# Altium project ePBR25_ACU_Power.PrjPCB (part 2 of 2)

## Sheet 9  - UV OV Protection.SchDoc
size A4
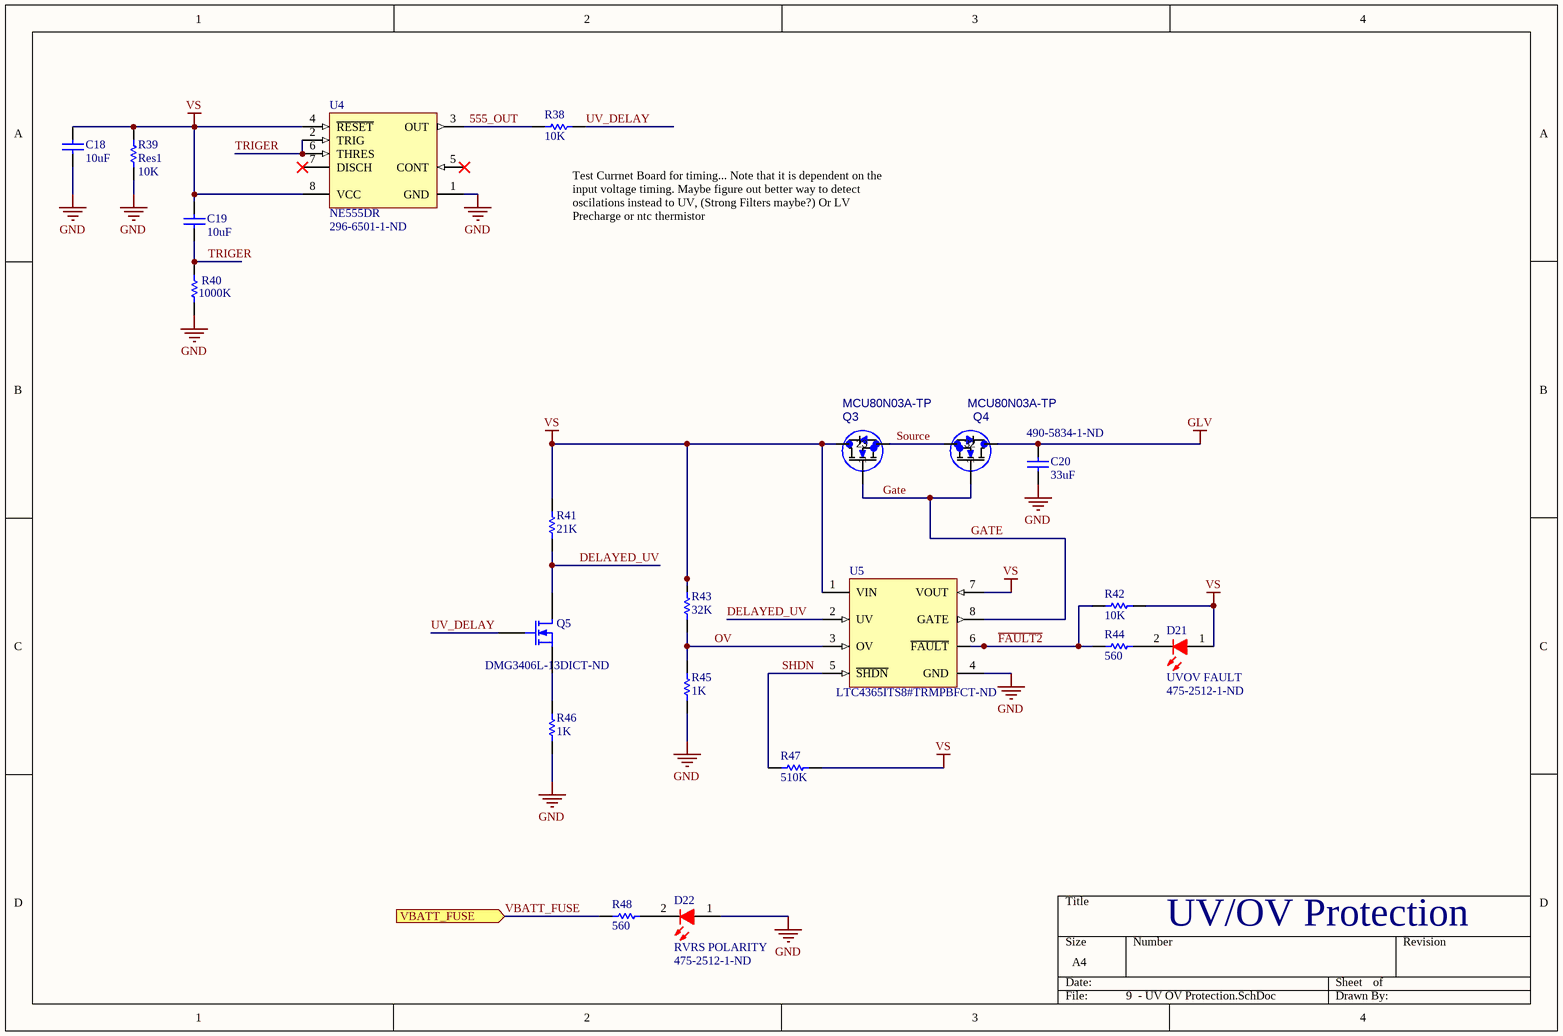
[diagram p6: 9  - UV OV Protection.SchDoc]

### Parts
C18  value 10uF  [1608[0603]]  (hidden comment: Cap Semi)
C19  value 10uF  [1608[0603]]  (hidden comment: Cap Semi)
C20  value 33uF  Supplier Part Number 1: 490-5834-1-ND  [2J-Lead 6.1 x 5.3]  (hidden comment: Cap Semi)
D21  UVOV FAULT  Supplier Part Number 1: 475-2512-1-ND  [TOSH-0603LED_RED_V]
D22  RVRS POLARITY  Supplier Part Number 1: 475-2512-1-ND  [TOSH-0603LED_RED_V]
Q3  MCU80N03A-TP  [MCU80N_MCE]
Q4  MCU80N03A-TP  [MCU80N_MCE]
Q5  Supplier Part Number 1: DMG3406L-13DICT-ND  [SOT-23_N]
R38  10K  [RESC0603(1608)_L]
R39  Res1  value 10K  [1608[0603]]
R40  1000K  [RESC0603(1608)_L]
R41  21K  [RESC0603(1608)_L]
R42  10K  [RESC0603(1608)_L]
R43  32K  [RESC0603(1608)_L]
R44  560  [RESC0603(1608)_L]
R45  1K  [RESC0603(1608)_L]
R46  1K  [RESC0603(1608)_L]
R47  510K  [RESC0603(1608)_L]
R48  560  [RESC0603(1608)_L]
U4  NE555DR  Supplier Part Number 1: 296-6501-1-ND  [D0008A_M]
U5  Supplier Part Number 1: LTC4365ITS8#TRMPBFCT-ND  [LT-TS8-8-TSOT-23_V]  (hidden comment: LTC4365ITS8#TRMPBF)

### Ports
VBATT_FUSE (in)

### Nets
GLV: C20.1 Q4.2
GND: C18.1 C20.2 D22.1(A) R39.1 R40.1 R45.1 R46.2 U4.1(GND) U5.4(GND)
VS: C18.2 C19.2 D21.1(A) Q3.2 R39.2 R41.1 R42.1 R43.2 R47.1 U4.4(~{RESET}) U4.8(VCC) U5.1(VIN) U5.7(VOUT)
555_OUT: R38.1 U4.3(OUT)
DELAYED_UV: Q5.3(D) R41.2 U5.2(UV)
~{FAULT2}: R42.2 R44.1 U5.6(~{FAULT})
GATE: Q3.1 Q4.1 U5.8(GATE)
OV: R43.1 R45.2 U5.3(OV)
SHDN: R47.2 U5.5(~{SHDN})
Source: Q3.3 Q4.3
TRIGER: C19.1 R40.2 U4.2(TRIG) U4.6(THRES)
UV_DELAY: Q5.1(G) R38.2
VBATT_FUSE: R48.1 ; port VBATT_FUSE
NetD21_2: D21.2(K) R44.2
NetD22_2: D22.2(K) R48.2
NetQ5_2: Q5.2(S) R46.1

Not connected (* = marked no-connect by the designer): U4 5(CONT)* 7(DISCH)*

### Notes on the sheet
- (near R38) Test Currnet Board for timing... Note that it is dependent on the input voltage timing. Maybe figure out better way to detect oscilations instead to UV, (Strong Filters maybe?) Or LV Precharge or ntc thermistor
- UV/OV Protection

### Library data of the parts
C18-C20 = Cap Semi: Capacitor (Semiconductor SIM Model); Published: 8-Jun-2000; LatestRevisionDate: 29-May-2009; LatestRevisionNote: IPC-7351 Footprint Added.; PackageReference: C1206; Publisher: Altium Limited; PackageDescription: Chip Capacitor; Supplier 1: Digi-Key
  C18 C19: Supplier Part Number 1: 490-10991-1-ND
D21 D22 = CMP-0444-00001-1: LED, Red 0603 (1608) 63mCd; Manufacturer: Toshiba; PartNumber: TLSU1008A(T04); Forward Current: 25 mA; Power Dissipation: 60 mW; Packing Type: Reel; Reverse Voltage: 4 V; Mounting Technology: Surface Mount; PackageDescription: 2-Pin SMT LED, 1.6 x 0.8 mm Pitch; ComponentLink1URL: http://www.toshiba-components.com/; ComponentLink1Description: Manufacturer URL; PackageReference: 0603LED_RED; ComponentLink2URL: http://www.semicon.toshiba.co.jp/info/docget.jsp?type=datasheet&lang=en&pid=TLSU1008A(T04); ComponentLink2Description: Datasheet; DatasheetVersion: Aug-08; Storage Temperature: -40 to 100 degC; Supplier 1: Digi-Key
Q3 Q4 = MCU80N03A-TP: Mfr_Name: MCC; C: Copyright (C) 2018 Accelerated Designs. All rights reserved; Copyright: Copyright (C) 2022 Ultra Librarian. All rights reserved.; Manufacturer_Part_Number: MCU80N03A-TP; Value: MCU80N03A-TP
Q5 = MOSFET-N: N-Channel MOSFET; Manufacturer: Infineon Technologies; Manufacturer Part Number: IPD075N03L G; FET Type: MOSFET N-Channel, Metal Oxide; FET Feature: Logic Level Gate; Drain to Source Voltage (Vdss): 30V; Current - Continuous Drain (Id) @ 25°C: 50A (Tc); Rds On (Max) @ Id, Vgs: 7.5 mOhm @ 30A, 10V; Vgs(th) (Max) @ Id: 2.2V @ 250µA; Gate Charge (Qg) @ Vgs: 18nC @ 10V; Input Capacitance (Ciss) @ Vds: 1900pF @ 15V; Power - Max: 47W; Published: 8-Jun-2000; LatestRevisionDate: 17-Jul-2002; LatestRevisionNote: Re-released for DXP Platform.; PackageVersion: 1995/1996; PackageReference: E3; Publisher: Altium Limited; PackageDescription: TO, Flat Index; 3 In-Line, Axial Leads; Body Dia. 4.6mm; Lead Dia. 0.5 mm (max); RoHS: RoHS Compliant; Category: Discrete Semiconductor Products; Packaging: Cut Tape (CT); Mounting Type: Surface Mount; Package / Case: TO-252-3, DPak (2 Leads + Tab), SC-63; Supplier Device Package: PG-TO252-3; ComponentLink1URL: http://www.infineon.com/dgdl/Infineon-IPD075N03LG-DS-v02_01-en.pdf?folderId=5546d4694909da4801490a07012f053b&fileId=db3a30431936bc4b011951d824f83aeb; ComponentLink1Description: http://www.infineon.com/dgdl/Infineon-IPD075N03LG-DS-v02_01-en.pdf?folderId=5546d4694909da4801490a07012f053b&fileId=db3a30431936bc4b011951d824f83aeb; ComponentLink2URL: http://www.semicon.toshiba.co.jp/info/docget.jsp?type=datasheet&lang=en&pid=SSM3K329R; ComponentLink2Description: http://www.semicon.toshiba.co.jp/info/docget.jsp?type=datasheet&lang=en&pid=SSM3K329R; Supplier 1: Digi-Key
R38 R40-R48 = CMP-1591-00001-1: 0603 (1608 Metric) Chip Resistor; Case-Metric: 1608; Case-EIA: 0603; PackageReference: RESC0603(1608)
  R38 R42: Supplier 1: Digi-Key; Supplier Part Number 1: 311-10KGRCT-ND
  R40 R43 R45: Supplier 1: Digi-Key
  R44: Supplier 1: Digi-Key; Supplier Part Number 1: P430BZCT-ND
  R48: Supplier 1: Digi-Key; Supplier Part Number 1: P560BZCT-ND
R39 = Res1: RES SMD 10K OHM 5% 1/4W 0603; Manufacturer: Rohm Semiconductor; Manufacturer Part Number: ESR03EZPJ103; Power (Watts): 0.25W, 1/4W; Temperature Coefficient: ±200ppm/°C; Published: 8-Jun-2000; LatestRevisionDate: 17-Jul-2002; LatestRevisionNote: Re-released for DXP Platform.; PackageReference: AXIAL-0.3; Publisher: Altium Limited; PackageDescription: Axial Device, Thru-Hole; 2 Leads; 0.3 in Pin Spacing; Supplier 1: Digi-Key; Supplier Part Number 1: RHM10KDCT-ND; RoHS: RoHS Compliant; Category: Resistors; Stock 1: 0; Pricing 1: 1=0.15, 10=0.119, 25=0.0824, 50=0.0642, 100=0.0458, 250=0.03568, 500=0.02836, 1000=0.02012 (CAD); Packaging: Cut Tape (CT); Part Status: Active; Resistance (Ohms): 10k; Tolerance: ±5%; Composition: Thick Film; Features: Automotive AEC-Q200, Pulse Withstanding; Operating Temperature: -55°C ~ 155°C; Package / Case: 0603 (1608 Metric); Supplier Device Package: 0603; Size / Dimension: 0.063" L x 0.031" W (1.60mm x 0.80mm); Height - Seated (Max): 0.022" (0.55mm); Failure Rate: -; ComponentLink1URL: http://rohmfs.rohm.com/en/products/databook/datasheet/passive/resistor/chip_resistor/esr.pdf; ComponentLink1Description: http://rohmfs.rohm.com/en/products/databook/datasheet/passive/resistor/chip_resistor/esr.pdf
U4 = CMP-1685-00007-1: Precision Timer, 4.5 to 16 V, 0 to 70 degC, 8-Pin SOIC (D8), Green (RoHS & no Sb/Br), Tape and Reel; Forward Voltage: 450 mV; Forward Current: 1 A; Max Surge Current: 30 A; Peak Reverse Current: 500 uA; Case\Package: SMA; PackageReference: D0008A; Width: 2.84 mm; PackageDescription: 8-Pin Small Outline Integrated Circuit, Body 4.9 x 3.9 mm, Pitch 1.27 mm; DatasheetVersion: SLFS022I, 09/2014; ComponentLink2Description: Datasheet; Package Quantity: 1; REACH SVHC: Unknown; Radiation Hardening: No; Height: 2.44 mm; Code_JEDEC: MS-012; Pins: 2; ComponentLink1Description: Manufacturer URL; ComponentLink3Description: Package Specification; ComponentLink3URL: http://www.ti.com/lit/ml/msoi002j/msoi002j.pdf; Length: 4.57 mm; ComponentLink1URL: http://www.ti.com/; Mount: Surface Mount; PackageVersion: 4040047-3/M, 06/2011; ComponentLink2URL: http://www.ti.com/general/docs/lit/getliterature.tsp?genericPartNumber=NE555&fileType=pdf; RoHSCompliant: true; Max Operating Temperature: 125 degC; Packaging: Cut Tape; Min Operating Temperature: -55 degC; Supplier 1: Digi-Key
U5 = CMP-0474-00861-1: UV, OV and Reverse Supply Protection Controller, 2.5 to 34 V Vin, 8-pin SOT23 (TS8-8), -40 to 85 degC, Pb-Free, Mini Tape and Reel; Manufacturer: Linear Technology; Fault: yes; Fast Comparator: no; Extended Temp: C, I, H; Circuit Breakers(#): 1; RoHS: TRUE; ComponentLink2URL: http://cds.linear.com/docs/en/datasheet/4365f.pdf; PartNumber: LTC4365ITS8#TRMPBF; ComponentLink3Description: Package Specification; Power Good: no; Packing: Mini Tape and Reel; ComponentLink2Description: Datasheet; Vin Range: 2.5 to 34 V; Active Limiting: no; Foldback: no; Reset: no; ComponentLink3URL: http://cds.linear.com/docs/en/packaging/SOT_8_05-08-1637.pdf; PackageVersion: Rev. A, 08/2010; Code_JEDEC: MO-193; ComponentLink1Description: Manufacturer URL; Mounting Technology: Surface Mount; ComponentLink1URL: http://www.linear.com/; PackageDescription: 8-Pin Plastic TSOT-23, Body 2.9 x 1.63 mm, Pitch 0.65 mm; PackageReference: TS8-8; Supplier 1: Digi-Key

## Sheet 10  - Latching Delay.SchDoc
size A4
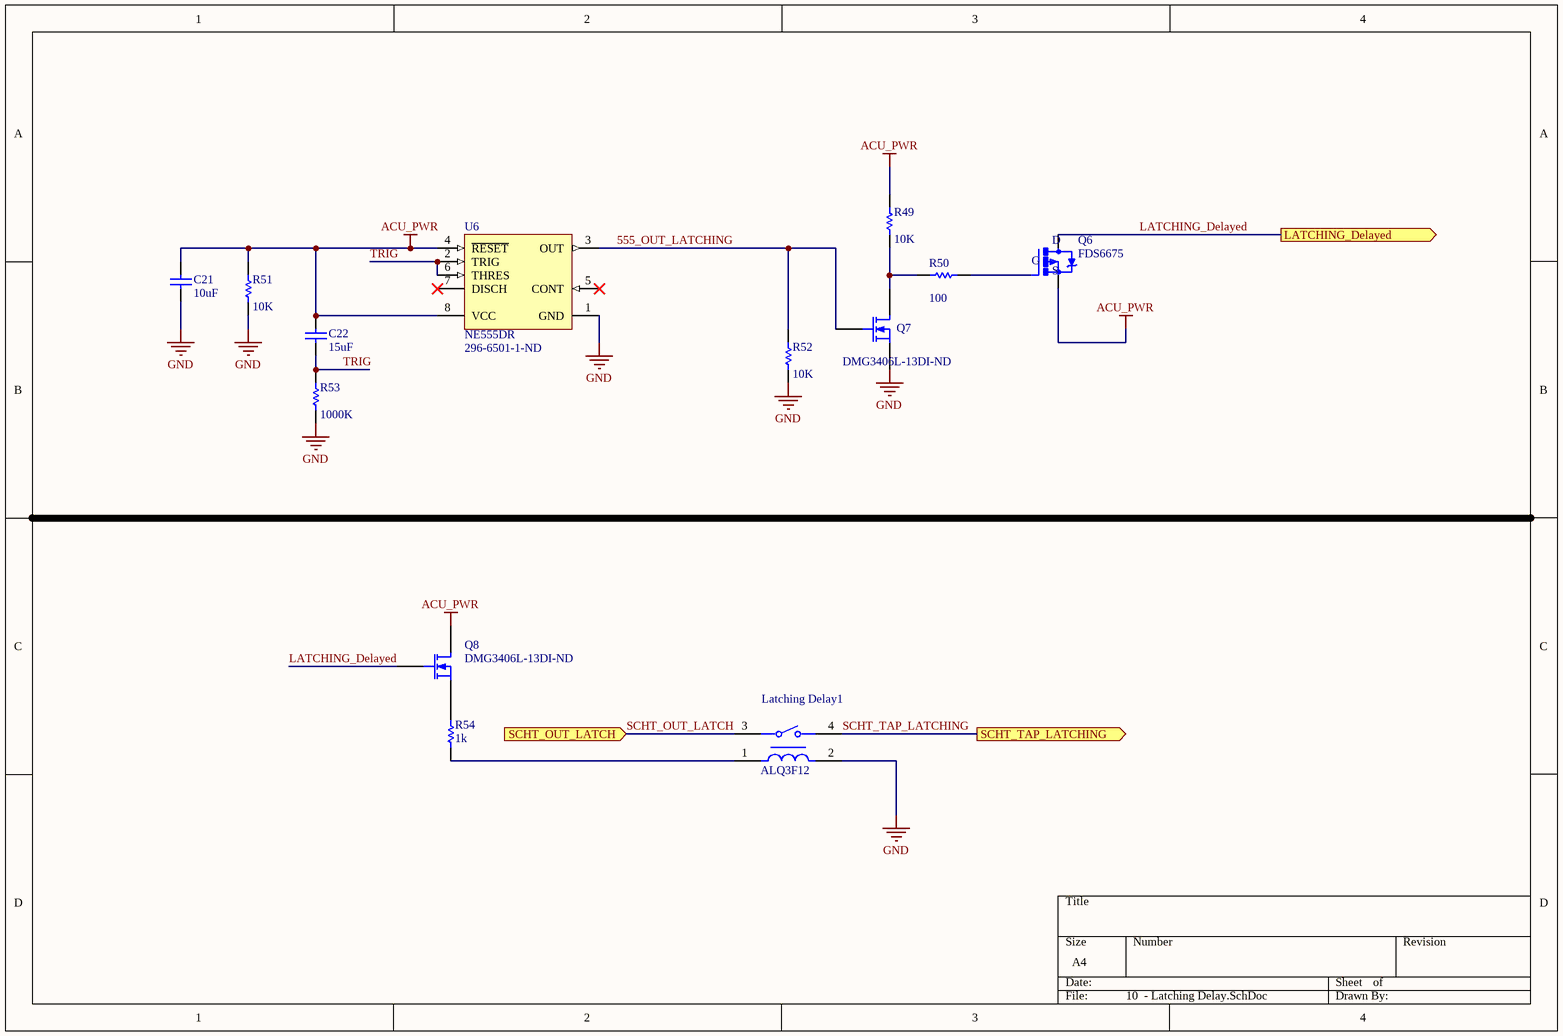
[diagram p7: 10  - Latching Delay.SchDoc]

### Parts
C21  value 10uF  [1608[0603]]  (hidden comment: Cap Semi)
C22  value 15uF  [1608[0603]]  (hidden comment: Cap Semi)
Latching_Delay1  ALQ3F12  [FP-ALQ3F12-MFG]
Q6  FDS6675  [SO08-E3]
Q7  Supplier Part Number 1: DMG3406L-13DI-ND  [SOT-23_N]
Q8  Supplier Part Number 1: DMG3406L-13DI-ND  [SOT-23_N]
R49  value 10K  [1608[0603]]  (hidden comment: Res1)
R50  value 100  [1608[0603]]  (hidden comment: Res1)
R51  value 10K  [1608[0603]]
R52  value 10K  [1608[0603]]  (hidden comment: Res1)
R53  value 1000K  [1608[0603]]  (hidden comment: Res1)
R54  value 1k  [1608[0603]]  (hidden comment: Res1)
U6  NE555DR  Supplier Part Number 1: 296-6501-1-ND  [D0008A_M]

### Ports
LATCHING_Delayed (out), SCHT_OUT_LATCH (in), SCHT_TAP_LATCHING (out)

### Nets
ACU_PWR: C21.2 C22.2 Q6.1-3(S) Q8.3(D) R49.2 R51.2 U6.4(~{RESET}) U6.8(VCC)
GND: C21.1 Latching_Delay1.2 Q7.2(S) R51.1 R52.1 R53.1 U6.1(GND)
555_OUT_LATCHING: Q7.1(G) R52.2 U6.3(OUT)
LATCHING_Delayed: Q6.5-8(D) Q8.1(G) ; port LATCHING_Delayed
SCHT_OUT_LATCH: Latching_Delay1.3 ; port SCHT_OUT_LATCH
SCHT_TAP_LATCHING: Latching_Delay1.4 ; port SCHT_TAP_LATCHING
TRIG: C22.1 R53.2 U6.2(TRIG) U6.6(THRES)
NetLatching_Delay1_1: Latching_Delay1.1 R54.2
NetQ6_4: Q6.4(G) R50.2
NetQ7_3: Q7.3(D) R49.1 R50.1
NetQ8_2: Q8.2(S) R54.1

Not connected (* = marked no-connect by the designer): U6 5(CONT)* 7(DISCH)*

### Library data of the parts
C21 C22 = Cap Semi: Capacitor (Semiconductor SIM Model); Published: 8-Jun-2000; LatestRevisionDate: 29-May-2009; LatestRevisionNote: IPC-7351 Footprint Added.; PackageReference: C1206; Publisher: Altium Limited; PackageDescription: Chip Capacitor; Supplier 1: Digi-Key; Supplier Part Number 1: 490-10991-1-ND
Latching_Delay1 = CMP-00287-47198074-1: ALQ3F12 ALQ Series SPST 10 A 12 V PC Pin Through Hole Class F Insulation Power Relay; Current Rating: 10A; Coil Voltage (DC): 12V; Relay Type: General Purpose; Number of Contacts: 1; Coil Power: 200mW; Coil Type: Non-Latching; Coil Current: 16.7mA; Coil Resistance: 720Ω; Operate Time: 20ms; Lead Free: Lead Free; Min Operating Temperature: -40°C; Switching Current: 10A; NexarPartId: 47198074; Contact Material: Silver; Max Operating Temperature: 85°C; Ambient Temperature Range High: 85°C; Termination: PC Pin; Height: 16.4mm; Throw Configuration: SPST; Mount: Through Hole; Contact Current Rating: 10A; RoHS: Compliant; Release Time: 20ms
Q6 = FDS6675: P-Channel 30V 11A _Ta_ 2.5W _Ta_ Surface Mount 8-SOIC; MF: ON Semiconductor; MP: FDS6675; Availability: Unavailable; SnapEDA_Link: https://www.snapeda.com/parts/FDS6675/ON%20Semiconductor/view-part/1666192/?ref=snap; Package: SO-8 ON Semiconductor; Value: *; Price: None
Q7 Q8 = MOSFET-N: as Q5 on sheet 9  - UV OV Protection; Published: 8-Jun-2000; LatestRevisionDate: 17-Jul-2002; LatestRevisionNote: Re-released for DXP Platform.; PackageVersion: 1995/1996; PackageReference: E3; Publisher: Altium Limited; PackageDescription: TO, Flat Index; 3 In-Line, Axial Leads; Body Dia. 4.6mm; Lead Dia. 0.5 mm (max); RoHS: RoHS Compliant; Category: Discrete Semiconductor Products; Packaging: Cut Tape (CT); Mounting Type: Surface Mount; Package / Case: TO-252-3, DPak (2 Leads + Tab), SC-63; Supplier Device Package: PG-TO252-3; ComponentLink1URL: http://www.infineon.com/dgdl/Infineon-IPD075N03LG-DS-v02_01-en.pdf?folderId=5546d4694909da4801490a07012f053b&fileId=db3a30431936bc4b011951d824f83aeb; ComponentLink1Description: http://www.infineon.com/dgdl/Infineon-IPD075N03LG-DS-v02_01-en.pdf?folderId=5546d4694909da4801490a07012f053b&fileId=db3a30431936bc4b011951d824f83aeb; ComponentLink2URL: http://www.semicon.toshiba.co.jp/info/docget.jsp?type=datasheet&lang=en&pid=SSM3K329R; ComponentLink2Description: http://www.semicon.toshiba.co.jp/info/docget.jsp?type=datasheet&lang=en&pid=SSM3K329R; Supplier 1: Digi-Key
R49 R51 R52 = Res1: as R39 on sheet 9  - UV OV Protection; Published: 8-Jun-2000; LatestRevisionDate: 17-Jul-2002; LatestRevisionNote: Re-released for DXP Platform.; PackageReference: AXIAL-0.3; Publisher: Altium Limited; PackageDescription: Axial Device, Thru-Hole; 2 Leads; 0.3 in Pin Spacing; Supplier 1: Digi-Key; Supplier Part Number 1: RHM10KDCT-ND; RoHS: RoHS Compliant; Category: Resistors; Stock 1: 0; Pricing 1: 1=0.15, 10=0.119, 25=0.0824, 50=0.0642, 100=0.0458, 250=0.03568, 500=0.02836, 1000=0.02012 (CAD); Packaging: Cut Tape (CT); Part Status: Active; Resistance (Ohms): 10k; Tolerance: ±5%; Composition: Thick Film; Features: Automotive AEC-Q200, Pulse Withstanding; Operating Temperature: -55°C ~ 155°C; Package / Case: 0603 (1608 Metric); Supplier Device Package: 0603; Size / Dimension: 0.063" L x 0.031" W (1.60mm x 0.80mm); Height - Seated (Max): 0.022" (0.55mm); Failure Rate: -; ComponentLink1URL: http://rohmfs.rohm.com/en/products/databook/datasheet/passive/resistor/chip_resistor/esr.pdf; ComponentLink1Description: http://rohmfs.rohm.com/en/products/databook/datasheet/passive/resistor/chip_resistor/esr.pdf
R50 = Res1: RES SMD 100 OHM 5% 1/4W 0603; Manufacturer: Rohm Semiconductor; Manufacturer Part Number: ESR03EZPJ101; Power (Watts): 0.25W, 1/4W; Temperature Coefficient: ±200ppm/°C; Published: 8-Jun-2000; LatestRevisionDate: 17-Jul-2002; LatestRevisionNote: Re-released for DXP Platform.; PackageReference: AXIAL-0.3; Publisher: Altium Limited; PackageDescription: Axial Device, Thru-Hole; 2 Leads; 0.3 in Pin Spacing; Supplier 1: Digi-Key; Supplier Part Number 1: RHM100DCT-ND; RoHS: RoHS Compliant; Category: Resistors; Stock 1: 57430; Pricing 1: 1=0.15, 10=0.119, 25=0.0824, 50=0.0642, 100=0.0458, 250=0.03568, 500=0.02836, 1000=0.02012 (CAD); Packaging: Cut Tape (CT); Part Status: Active; Resistance (Ohms): 100; Tolerance: ±5%; Composition: Thick Film; Features: Automotive AEC-Q200, Pulse Withstanding; Operating Temperature: -55°C ~ 155°C; Package / Case: 0603 (1608 Metric); Supplier Device Package: 0603; Size / Dimension: 0.063" L x 0.031" W (1.60mm x 0.80mm); Height - Seated (Max): 0.022" (0.55mm); Failure Rate: -; ComponentLink1URL: http://rohmfs.rohm.com/en/products/databook/datasheet/passive/resistor/chip_resistor/esr.pdf; ComponentLink1Description: http://rohmfs.rohm.com/en/products/databook/datasheet/passive/resistor/chip_resistor/esr.pdf
R53 = Res1: RES SMD 33K OHM 5% 1/4W 0603; Manufacturer: Rohm Semiconductor; Manufacturer Part Number: ESR03EZPJ333; Power (Watts): 0.25W, 1/4W; Temperature Coefficient: ±200ppm/°C; Published: 8-Jun-2000; LatestRevisionDate: 17-Jul-2002; LatestRevisionNote: Re-released for DXP Platform.; PackageReference: AXIAL-0.3; Publisher: Altium Limited; PackageDescription: Axial Device, Thru-Hole; 2 Leads; 0.3 in Pin Spacing; Supplier 1: Digi-Key; Supplier Part Number 1: RHM33KDCT-ND; RoHS: RoHS Compliant; Category: Resistors; Stock 1: 5269; Pricing 1: 1=0.15, 10=0.119, 25=0.0824, 50=0.0642, 100=0.0458, 250=0.03568, 500=0.02836, 1000=0.02012 (CAD); Packaging: Cut Tape (CT); Part Status: Active; Resistance (Ohms): 33k; Tolerance: ±5%; Composition: Thick Film; Features: Automotive AEC-Q200, Pulse Withstanding; Operating Temperature: -55°C ~ 155°C; Package / Case: 0603 (1608 Metric); Supplier Device Package: 0603; Size / Dimension: 0.063" L x 0.031" W (1.60mm x 0.80mm); Height - Seated (Max): 0.022" (0.55mm); Failure Rate: -; ComponentLink1URL: http://rohmfs.rohm.com/en/products/databook/datasheet/passive/resistor/chip_resistor/esr.pdf; ComponentLink1Description: http://rohmfs.rohm.com/en/products/databook/datasheet/passive/resistor/chip_resistor/esr.pdf
R54 = Res1: RES SMD 100 OHM 5% 1/4W 0603; Manufacturer: Rohm Semiconductor; Manufacturer Part Number: ESR03EZPJ101; Resistance (Ohms): 100; Power (Watts): 0.25W, 1/4W; Temperature Coefficient: ±200ppm/°C; Published: 8-Jun-2000; LatestRevisionDate: 17-Jul-2002; LatestRevisionNote: Re-released for DXP Platform.; PackageReference: AXIAL-0.3; Publisher: Altium Limited; PackageDescription: Axial Device, Thru-Hole; 2 Leads; 0.3 in Pin Spacing; Supplier 1: Digi-Key; Supplier Part Number 1: RHM100DCT-ND; RoHS: RoHS Compliant; Category: Resistors; Stock 1: 57430; Pricing 1: 1=0.15, 10=0.119, 25=0.0824, 50=0.0642, 100=0.0458, 250=0.03568, 500=0.02836, 1000=0.02012 (CAD); Packaging: Cut Tape (CT); Part Status: Active; Tolerance: ±5%; Composition: Thick Film; Features: Automotive AEC-Q200, Pulse Withstanding; Operating Temperature: -55°C ~ 155°C; Package / Case: 0603 (1608 Metric); Supplier Device Package: 0603; Size / Dimension: 0.063" L x 0.031" W (1.60mm x 0.80mm); Height - Seated (Max): 0.022" (0.55mm); Failure Rate: -; ComponentLink1URL: http://rohmfs.rohm.com/en/products/databook/datasheet/passive/resistor/chip_resistor/esr.pdf; ComponentLink1Description: http://rohmfs.rohm.com/en/products/databook/datasheet/passive/resistor/chip_resistor/esr.pdf
U6 = CMP-1685-00007-1: as U4 on sheet 9  - UV OV Protection; PackageReference: D0008A; Width: 2.84 mm; PackageDescription: 8-Pin Small Outline Integrated Circuit, Body 4.9 x 3.9 mm, Pitch 1.27 mm; DatasheetVersion: SLFS022I, 09/2014; ComponentLink2Description: Datasheet; Package Quantity: 1; REACH SVHC: Unknown; Radiation Hardening: No; Height: 2.44 mm; Code_JEDEC: MS-012; Pins: 2; ComponentLink1Description: Manufacturer URL; ComponentLink3Description: Package Specification; ComponentLink3URL: http://www.ti.com/lit/ml/msoi002j/msoi002j.pdf; Length: 4.57 mm; ComponentLink1URL: http://www.ti.com/; Mount: Surface Mount; PackageVersion: 4040047-3/M, 06/2011; ComponentLink2URL: http://www.ti.com/general/docs/lit/getliterature.tsp?genericPartNumber=NE555&fileType=pdf; RoHSCompliant: true; Max Operating Temperature: 125 degC; Packaging: Cut Tape; Min Operating Temperature: -55 degC; Supplier 1: Digi-Key

## Nets that join several sheets
3V3: 2  - Power Switch (5 pins), 1  - Connectors (5 pins), 2  - Battery Sensing and Control (C16.1 R32.2 R33.2 U3.5), 8  - Voltage Conversions Delays (C12.2 R28.1 R29.2 U1.3)
5V: 1  - Connectors (CON2.B4 CON2.B7 L2.2), 3  - Fuses (F15.1), 8  - Voltage Conversions Delays (C15.2 R30.1 R31.2 U2#2.3)
ACU_PWR: 1  - Connectors (CON1.A7 CON2.A8 L1.1), 3  - Fuses (ACU_PWR1.1 D2.1 F10.3 F10.4), 6  - Load Drivers (Q2.3), 8  - Voltage Conversions Delays (6 pins), 10  - Latching Delay (8 pins)
GLV: 3  - Fuses (20 pins), 6  - Load Drivers (11 pins), 9  - UV OV Protection (C20.1 Q4.2)
GND: 2  - Power Switch (C4#1.2 U2#1.4), 1  - Connectors (27 pins), 2  - Battery Sensing and Control (5 pins), 3  - Fuses (17 pins), 6  - Load Drivers (21 pins), 8  - Voltage Conversions Delays (12 pins), 9  - UV OV Protection (9 pins), 10  - Latching Delay (7 pins)
VS: 2  - Battery Sensing and Control (K1.COM), 9  - UV OV Protection (13 pins)
ACC_FAN_CTRL: 1  - Connectors (CN1.21), 6  - Load Drivers (R23.1)
ACC_FAN_PWR: 3  - Fuses (D10.1 F9.3 F9.4), 6  - Load Drivers (C8.2 C9.2 LD4.3)
ACC_FAN_PWR_IN: 1  - Connectors (CN1.3), 6  - Load Drivers (LD4.1 LD4.5 R25.1)
AMS_PWR: 1  - Connectors (CN1.5), 3  - Fuses (D3.1 F2.3 F2.4)
BRAKE_PWR: 1  - Connectors (CN2.16), 3  - Fuses (D9.1 F8.3 F8.4)
BSPD_TEST: 1  - Connectors (CN1.1), 3  - Fuses (J1.1)
BUZR_CTRL: 1  - Connectors (CON1.A5), 6  - Load Drivers (LD2.3)
BUZR_FB: 1  - Connectors (CON2.B5), 6  - Load Drivers (LD2.4)
BUZR_FUSE: 3  - Fuses (F1.1 F1.2), 6  - Load Drivers (LD2.10 LD2.11 R19#2.1)
BUZR_PWR: 1  - Connectors (CN2.25), 3  - Fuses (D1.1 F1.3 F1.4)
EMETER_PWR: 1  - Connectors (CN1.6), 3  - Fuses (D8.1 F7.3 F7.4)
FANS_CTRL: 1  - Connectors (CON1.B7), 6  - Load Drivers (LD1.3)
FANS_FB: 1  - Connectors (CON2.B6), 6  - Load Drivers (LD1.4)
FANS_FUSE: 3  - Fuses (F6.1 F6.2), 6  - Load Drivers (6 pins)
FANS_PWR: 1  - Connectors (CN2.31), 3  - Fuses (D7.1 F6.3 F6.4)
HCP_SENS_PWR: 1  - Connectors (CN1.24), 3  - Fuses (D15.1 F15.2)
HVB_PWR: 1  - Connectors (CN1.2), 3  - Fuses (D14.1 F14.3 F14.4)
IMD_PWR: 1  - Connectors (CN1.27), 3  - Fuses (D5.1 F4.3 F4.4)
LATCHING_Delayed: 1  - Connectors (L4.3), 10  - Latching Delay (Q6.5-8 Q8.1)
MC_PWR: 1  - Connectors (CN2.27), 3  - Fuses (D12.1 F12.3 F12.4)
MC_PWR_CTRL: 1  - Connectors (CON1.A2), 6  - Load Drivers (LD2.6)
MC_PWR_FB: 1  - Connectors (CON2.A5), 6  - Load Drivers (LD2.5)
MC_PWR_FUSE: 3  - Fuses (F12.1 F12.2), 6  - Load Drivers (LD2.8 LD2.9 R20#2.1)
PUMP_CTRL: 1  - Connectors (CON1.B6), 6  - Load Drivers (LD3.3)
PUMP_FB: 1  - Connectors (CON2.A9), 6  - Load Drivers (LD3.4)
PUMP_FUSE: 3  - Fuses (F3.1 F3.2), 6  - Load Drivers (6 pins)
PUMP_PWR: 1  - Connectors (CN2.34), 3  - Fuses (D4.1 F3.3 F3.4)
PWR_MON_SCL: 1  - Connectors (CON2.B3), 2  - Battery Sensing and Control (R33.1 U3.7)
PWR_MON_SDA: 1  - Connectors (CON2.B2), 2  - Battery Sensing and Control (R32.1 U3.6)
SCHT_OUT_LATCH: 1  - Connectors (L3.1), 10  - Latching Delay (Latching_Delay1.3)
SCHT_TAP_LATCHING: 1  - Connectors (CN2.19), 10  - Latching Delay (Latching_Delay1.4)
STATUS_LIGHT_PWR: 1  - Connectors (CN2.26), 3  - Fuses (D11.1 F11.3 F11.4)
VBATT_FUSE: 1  - Connectors (CN1.36), 2  - Battery Sensing and Control (R34.2 R35#2.2 U3.1), 3  - Fuses (D13.1 F13.3 F13.4), 9  - UV OV Protection (R48.1)
VBATT_RAW: 1  - Connectors (WM1.1), 3  - Fuses (C1.1 F13.1 F13.2)
VCU_PWR: 1  - Connectors (CN2.13), 3  - Fuses (D6.1 F5.3 F5.4)
VS_SWITCH: 1  - Connectors (CN2.39), 2  - Battery Sensing and Control (K1.A1)
VS_TO_SWITCH: 1  - Connectors (CN2.37), 2  - Battery Sensing and Control (K1.NO R35#2.1 R36.2)